# Altium schematic sheet alu_mux_schem.SchDoc
size A; SheetNumber: 3; SheetTotal: 4
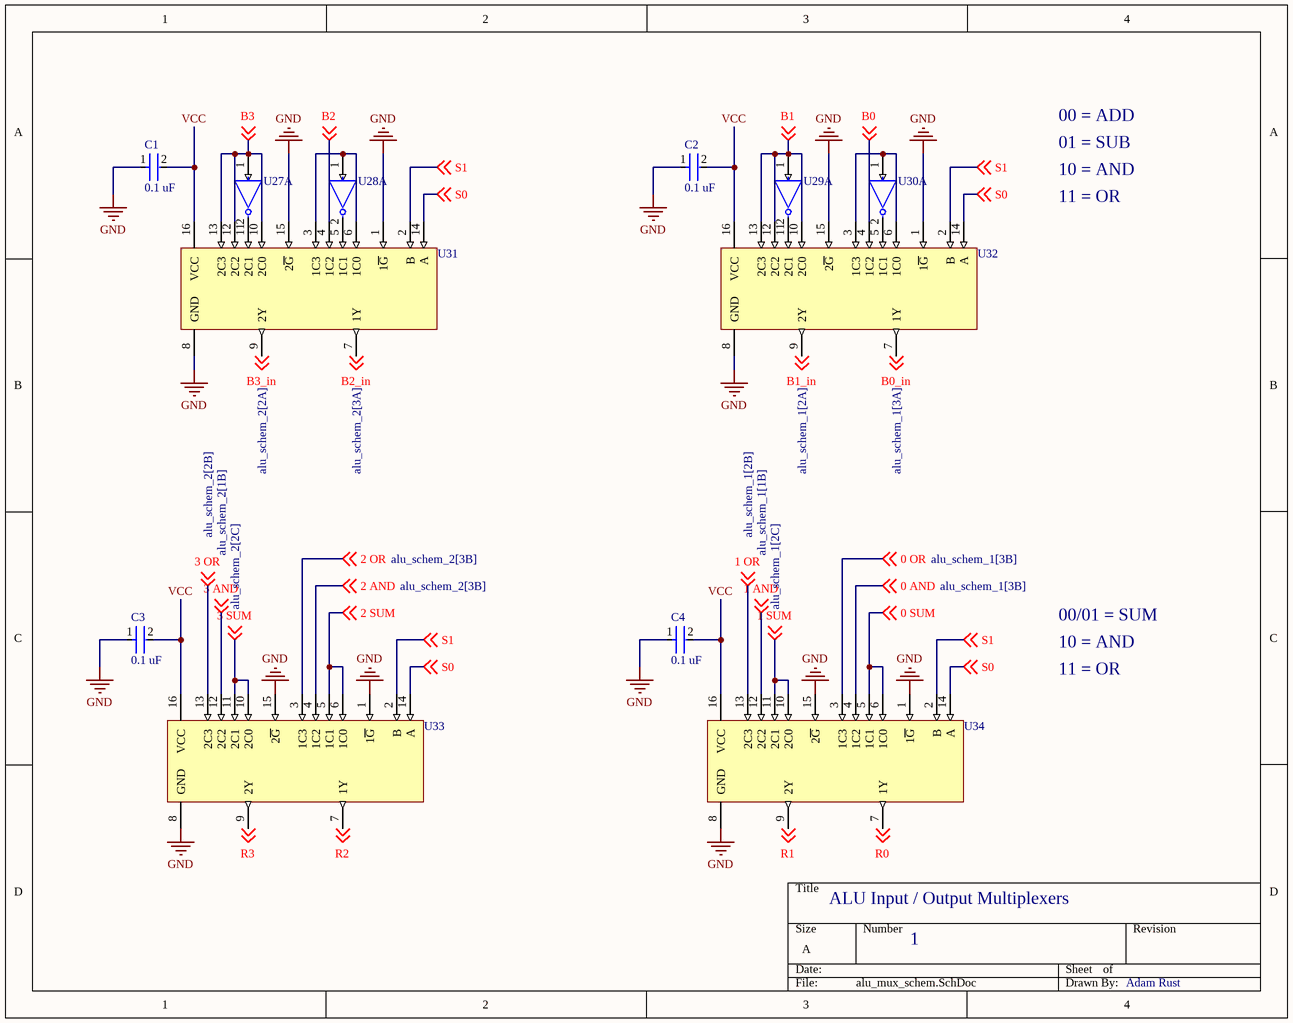
[diagram p0: alu_mux_schem.SchDoc]

## Parts
C1  0.1 uF  [FP-GRM022-0_02-MFG]
C2  0.1 uF  [FP-GRM022-0_02-MFG]
C3  0.1 uF  [FP-GRM022-0_02-MFG]
C4  0.1 uF  [FP-GRM022-0_02-MFG]
U27  SN74LVC04ADR  [FP-D0014A-IPC_A]  (value not drawn)  (part A of 7)
U28  SN74LVC04ADR  [FP-D0014A-IPC_A]  (value not drawn)  (part A of 7)
U29  SN74LVC04ADR  [FP-D0014A-IPC_A]  (value not drawn)  (part A of 7)
U30  SN74LVC04ADR  [FP-D0014A-IPC_A]  (value not drawn)  (part A of 7)
U31  SN74HC153DR  [D0016A_N]  (value not drawn)
U32  SN74HC153DR  [D0016A_N]  (value not drawn)
U33  SN74HC153DR  [D0016A_N]  (value not drawn)
U34  SN74HC153DR  [D0016A_N]  (value not drawn)

## Nets
GND: C1.1 C2.1 C3.1 C4.1 U31.1(1~{G}) U31.8(GND) U31.15(2~{G}) U32.1(1~{G}) U32.8(GND) U32.15(2~{G}) U33.1(1~{G}) U33.8(GND) U33.15(2~{G}) U34.1(1~{G}) U34.8(GND) U34.15(2~{G})
0 AND: U34.4(1C2) ; off-sheet 0 AND
0 OR: U34.3(1C3) ; off-sheet 0 OR
0 SUM: U34.5(1C1) U34.6(1C0) ; off-sheet 0 SUM
1 AND: U34.12(2C2) ; off-sheet 1 AND
1 OR: U34.13(2C3) ; off-sheet 1 OR
1 SUM: U34.10(2C0) U34.11(2C1) ; off-sheet 1 SUM
2 AND: U33.4(1C2) ; off-sheet 2 AND
2 OR: U33.3(1C3) ; off-sheet 2 OR
2 SUM: U33.5(1C1) U33.6(1C0) ; off-sheet 2 SUM
3 AND: U33.12(2C2) ; off-sheet 3 AND
3 OR: U33.13(2C3) ; off-sheet 3 OR
3 SUM: U33.10(2C0) U33.11(2C1) ; off-sheet 3 SUM
B0: U32.4(1C2) ; off-sheet B0
B0_in: U32.7(1Y) ; off-sheet B0_in
B1: U29.1(1A) U32.10(2C0) U32.12(2C2) U32.13(2C3) ; off-sheet B1
B1_in: U32.9(2Y) ; off-sheet B1_in
B2: U31.4(1C2) ; off-sheet B2
B2_in: U31.7(1Y) ; off-sheet B2_in
B3: U27.1(1A) U31.10(2C0) U31.12(2C2) U31.13(2C3) ; off-sheet B3
B3_in: U31.9(2Y) ; off-sheet B3_in
R0: U34.7(1Y) ; off-sheet R0
R1: U34.9(2Y) ; off-sheet R1
R2: U33.7(1Y) ; off-sheet R2
R3: U33.9(2Y) ; off-sheet R3
S0: U31.14(A) U32.14(A) U33.14(A) U34.14(A) ; off-sheet S0
S1: U31.2(B) U32.2(B) U33.2(B) U34.2(B) ; off-sheet S1
VCC: C1.2 C2.2 C3.2 C4.2 U31.16(VCC) U32.16(VCC) U33.16(VCC) U34.16(VCC)
NetU27_2: U27.2(1Y) U31.11(2C1)
NetU28_1: U28.1(1A) U31.3(1C3) U31.6(1C0)
NetU28_2: U28.2(1Y) U31.5(1C1)
NetU29_2: U29.2(1Y) U32.11(2C1)
NetU30_1: U30.1(1A) U32.3(1C3) U32.6(1C0)
NetU30_2: U30.2(1Y) U32.5(1C1)

## Notes on the sheet
- 00 = ADD
- 01 = SUB
- 10 = AND
- 11 = OR
- 00/01 = SUM
- ALU Input / Output Multiplexers
- 1
- Adam Rust

## Library data of the parts
C1-C4 = CMP-00260-135708700-1: GRM022R61C104ME05L Multilayer Ceramic Capacitor, 0.1 uF, 16 V, ± 20%, X5R, 01005 [0402 Metric]; Voltage Rating (DC): 16V; Capacitance: 100nF; Dielectric: X5R; Length: 400µm; Material: Ceramic; Case/Package: 0402; Max Operating Temperature: 85°C; Thickness: 200µm; Voltage Rating: 16V; Min Operating Temperature: -55°C; Lifecycle Status: Production; Tolerance: 20%; Width: 200µm; Height: 400µm; NexarPartId: 135708700
U27-U30 = CMP-1615-00157-3: IC INVERTER 6CH 6-INP 14SOIC; High Level Output Current: -24mA; Number of Gates: 6; Max Supply Voltage: 3.6V; Output Current: 24mA; Quiescent Current: 1uA; Min Supply Voltage: 1.65V; Number of Inputs: 1; Logic Function: Buffer; Turn-On Delay Time: 4.5ns; Propagation Delay: 9.5ns; Number of Pins: 14; Weight: 0.004318oz; Number of Bits: 6; Number of Elements: 6; Min Operating Temperature: -40°C; Case/Package: SOIC; Technology: CMOS; Mount: Surface Mount; Package Quantity: 1; Low Level Output Current: 24mA; Radiation Hardening: No; Lead Free: Lead Free; Series: 74LVC; Max Operating Temperature: 125°C; RoHS Compliant: Yes; Packaging: Tape and Reel; REACH SVHC: No SVHC; Contact Plating: Gold; Number of Circuits: 6
U31-U34 = CMP-1628-00005-2: Dual 4-Line To 1-Line Data Selectors/Multiplexers, D0016A, LARGE T&R; Manufacturer: Texas Instruments; tpd @ Nom Voltage(Max)(ns): 38; Configuration: 4：1; Channels(#): 2; Bits(#): 4; Function: Encoder/Multiplexer; Input Type: LVTTL/CMOS; VCC(Max)(V): 6; ICC @ Nom Voltage(Max)(mA): 8; Output Type: CMOS; Output Drive (IOL/IOH)(Max)(mA): 7.8/-7.8; Technology Family: HC; F @ Nom Voltage(Max)(Mhz): 28; Schmitt Trigger: No; Rating: Catalog; Voltage(Nom)(V): 3.3,5; Code_JEDEC: MS-012 variation AC; Operating Temperature Range(C): -40 to 85; DatasheetVersion: SCLS112D; Type: Standard; VCC(Min)(V): 2; Generic Part Number: SN74HC153; PackageReference: D0016A